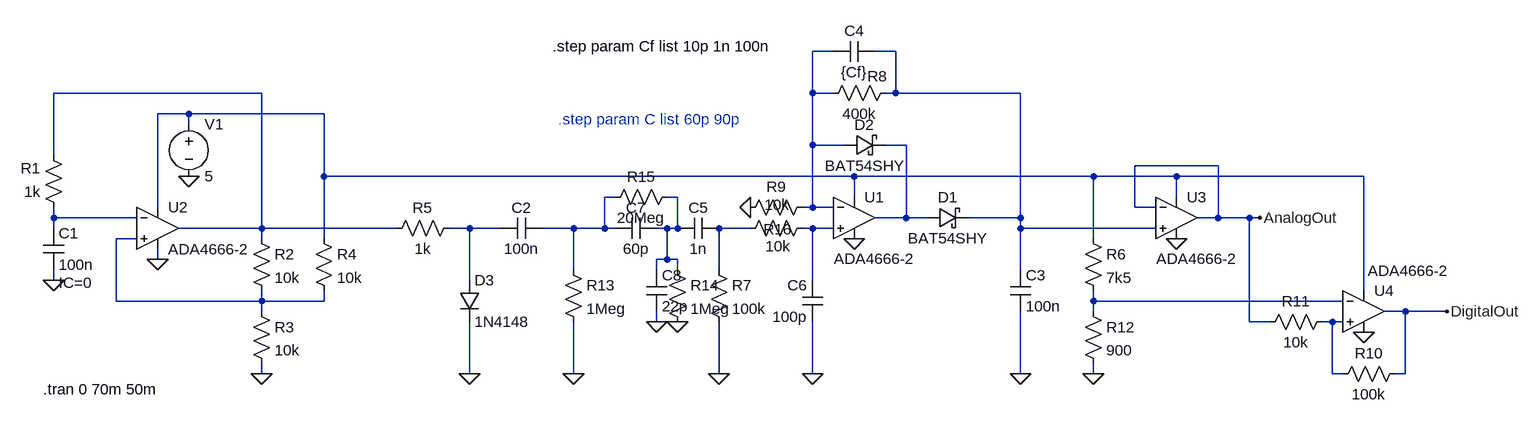
[diagram p0: schematic RainSensor.asc]
RainSensor.asc, the LTspice schematic file:
Version 4
SHEET 1 2296 680
WIRE 1216 -192 1184 -192
WIRE 1312 -192 1280 -192
WIRE 336 -128 16 -128
WIRE 1184 -128 1184 -192
WIRE 1216 -128 1184 -128
WIRE 1312 -128 1312 -192
WIRE 1312 -128 1296 -128
WIRE 1504 -128 1312 -128
WIRE 224 -96 176 -96
WIRE 432 -96 224 -96
WIRE 224 -80 224 -96
WIRE 1184 -48 1184 -128
WIRE 1232 -48 1184 -48
WIRE 1328 -48 1296 -48
WIRE 16 -32 16 -128
WIRE 1808 -16 1680 -16
WIRE 432 0 432 -96
WIRE 1248 0 432 0
WIRE 1616 0 1248 0
WIRE 1744 0 1616 0
WIRE 2032 0 1744 0
WIRE 880 32 864 32
WIRE 976 32 960 32
WIRE 1248 32 1248 0
WIRE 1744 32 1744 0
WIRE 176 48 176 -96
WIRE 1184 48 1184 -48
WIRE 1184 48 1168 48
WIRE 1216 48 1184 48
WIRE 1680 48 1680 -16
WIRE 1712 48 1680 48
WIRE 16 64 16 48
WIRE 144 64 16 64
WIRE 1328 64 1328 -48
WIRE 1328 64 1280 64
WIRE 1360 64 1328 64
WIRE 1504 64 1504 -128
WIRE 1504 64 1424 64
WIRE 1808 64 1808 -16
WIRE 1808 64 1776 64
WIRE 1856 64 1808 64
WIRE 1872 64 1856 64
WIRE 16 80 16 64
WIRE 336 80 336 -128
WIRE 336 80 208 80
WIRE 544 80 336 80
WIRE 656 80 624 80
WIRE 704 80 656 80
WIRE 816 80 768 80
WIRE 864 80 864 32
WIRE 864 80 816 80
WIRE 880 80 864 80
WIRE 960 80 944 80
WIRE 976 80 976 32
WIRE 976 80 960 80
WIRE 1088 80 1040 80
WIRE 1184 80 1168 80
WIRE 1216 80 1184 80
WIRE 1504 80 1504 64
WIRE 1712 80 1504 80
WIRE 144 96 112 96
WIRE 336 96 336 80
WIRE 432 96 432 0
WIRE 1616 96 1616 0
WIRE 176 128 176 112
WIRE 960 128 960 80
WIRE 960 128 944 128
WIRE 976 128 960 128
WIRE 816 144 816 80
WIRE 944 144 944 128
WIRE 976 144 976 128
WIRE 1040 144 1040 80
WIRE 1504 144 1504 80
WIRE 16 160 16 144
WIRE 656 160 656 80
WIRE 1184 160 1184 80
WIRE 2032 176 2032 0
WIRE 112 192 112 96
WIRE 336 192 336 176
WIRE 336 192 112 192
WIRE 432 192 432 176
WIRE 432 192 336 192
WIRE 1616 192 1616 176
WIRE 2000 192 1616 192
WIRE 336 208 336 192
WIRE 1616 208 1616 192
WIRE 2096 208 2064 208
WIRE 2160 208 2096 208
WIRE 944 224 944 208
WIRE 1856 224 1856 64
WIRE 1888 224 1856 224
WIRE 1984 224 1968 224
WIRE 2000 224 1984 224
WIRE 336 304 336 288
WIRE 656 304 656 224
WIRE 816 304 816 224
WIRE 1040 304 1040 224
WIRE 1184 304 1184 224
WIRE 1504 304 1504 208
WIRE 1616 304 1616 288
WIRE 1984 304 1984 224
WIRE 2000 304 1984 304
WIRE 2096 304 2096 208
WIRE 2096 304 2080 304
FLAG 224 0 0
FLAG 176 128 0
FLAG 16 160 0
FLAG 336 304 0
FLAG 656 304 0
FLAG 1040 304 0
FLAG 1248 96 0
FLAG 1088 48 0
FLAG 1504 304 0
FLAG 1744 96 0
FLAG 2032 240 0
FLAG 1616 304 0
FLAG 2160 208 DigitalOut
FLAG 1872 64 AnalogOut
FLAG 816 304 0
FLAG 1184 304 0
FLAG 976 224 0
FLAG 944 224 0
SYMBOL voltage 224 -96 R0
WINDOW 123 0 0 Left 0
WINDOW 39 0 0 Left 0
SYMATTR InstName V1
SYMATTR Value 5
SYMBOL res 32 64 R180
WINDOW 0 36 76 Left 2
WINDOW 3 36 40 Left 2
SYMATTR InstName R1
SYMATTR Value 1k
SYMBOL res 320 80 R0
SYMATTR InstName R2
SYMATTR Value 10k
SYMBOL res 320 192 R0
SYMATTR InstName R3
SYMATTR Value 10k
SYMBOL cap 0 80 R0
WINDOW 39 24 84 Left 2
SYMATTR SpiceLine IC=0
SYMATTR InstName C1
SYMATTR Value 100n
SYMBOL OpAmps\\ADA4666-2 176 16 R0
SYMATTR InstName U2
SYMBOL res 416 80 R0
SYMATTR InstName R4
SYMATTR Value 10k
SYMBOL res 640 64 R90
WINDOW 0 0 56 VBottom 2
WINDOW 3 32 56 VTop 2
SYMATTR InstName R5
SYMATTR Value 1k
SYMBOL cap 768 64 R90
WINDOW 0 0 32 VBottom 2
WINDOW 3 32 32 VTop 2
SYMATTR InstName C2
SYMATTR Value 100n
SYMBOL res 1024 128 R0
SYMATTR InstName R7
SYMATTR Value 100k
SYMBOL OpAmps\\ADA4666-2 1248 0 R0
WINDOW 3 -31 127 Left 2
SYMATTR InstName U1
SYMBOL res 1312 -144 R90
WINDOW 0 6 28 VBottom 2
WINDOW 3 32 56 VTop 2
SYMATTR InstName R8
SYMATTR Value 400k
SYMBOL res 1184 32 R90
WINDOW 0 0 56 VBottom 2
WINDOW 3 -4 55 VTop 2
SYMATTR InstName R9
SYMATTR Value 10k
SYMBOL cap 1488 144 R0
WINDOW 39 24 84 Left 2
SYMATTR InstName C3
SYMATTR Value 100n
SYMBOL schottky 1232 -32 R270
WINDOW 0 32 32 VTop 2
WINDOW 3 0 32 VBottom 2
SYMATTR InstName D2
SYMATTR Value BAT54SHY
SYMATTR Description Diode
SYMATTR Type diode
SYMBOL OpAmps\\ADA4666-2 1744 0 R0
WINDOW 3 -31 127 Left 2
SYMATTR InstName U3
SYMBOL schottky 1360 80 R270
WINDOW 0 32 32 VTop 2
WINDOW 3 0 32 VBottom 2
SYMATTR InstName D1
SYMATTR Value BAT54SHY
SYMATTR Description Diode
SYMATTR Type diode
SYMBOL diode 640 160 R0
SYMATTR InstName D3
SYMATTR Value 1N4148
SYMBOL cap 1280 -208 R90
WINDOW 0 0 32 VBottom 2
WINDOW 3 32 32 VTop 2
SYMATTR InstName C4
SYMATTR Value {Cf}
SYMBOL OpAmps\\ADA4666-2 2032 144 R0
WINDOW 3 6 1 Left 2
SYMATTR InstName U4
SYMBOL res 2096 288 R90
WINDOW 0 0 56 VBottom 2
WINDOW 3 32 56 VTop 2
SYMATTR InstName R10
SYMATTR Value 100k
SYMBOL res 1600 80 R0
SYMATTR InstName R6
SYMATTR Value 7k5
SYMBOL res 1600 192 R0
SYMATTR InstName R12
SYMATTR Value 900
SYMBOL res 1984 208 R90
WINDOW 0 0 56 VBottom 2
WINDOW 3 32 56 VTop 2
SYMATTR InstName R11
SYMATTR Value 10k
SYMBOL res 800 128 R0
SYMATTR InstName R13
SYMATTR Value 1Meg
SYMBOL cap 1040 64 R90
WINDOW 0 0 32 VBottom 2
WINDOW 3 32 32 VTop 2
SYMATTR InstName C5
SYMATTR Value 1n
SYMBOL cap 1200 224 R180
WINDOW 0 24 56 Left 2
WINDOW 3 24 8 Left 2
SYMATTR InstName C6
SYMATTR Value 100p
SYMBOL cap 944 64 R90
WINDOW 0 0 32 VBottom 2
WINDOW 3 32 32 VTop 2
SYMATTR InstName C7
SYMATTR Value 60p
SYMBOL res 976 16 R90
WINDOW 0 0 56 VBottom 2
WINDOW 3 32 56 VTop 2
SYMATTR InstName R15
SYMATTR Value 20Meg
SYMBOL res 1184 64 R90
WINDOW 0 33 54 VBottom 2
WINDOW 3 28 53 VTop 2
SYMATTR InstName R16
SYMATTR Value 10k
SYMBOL res 960 128 R0
SYMATTR InstName R14
SYMATTR Value 1Meg
SYMBOL cap 928 144 R0
SYMATTR InstName C8
SYMATTR Value 22p
TEXT 0 328 Left 2 !.tran 0 70m 50m
TEXT 792 -88 Left 2 ;.step param C list 60p 90p
TEXT 784 -200 Left 2 !.step param Cf list 10p 1n 100n

The netlist it stands for:
* RainSensor.asc
V1 N004 0 5
R1 N008 N003 1k
R2 N003 N012 10k
R3 N012 0 10k
C1 N008 0 100n IC=0
XU2 N012 N008 N004 0 N003 ADA4666-2  ; pins In+ In- V+ V- OUT
R4 N004 N012 10k
R5 N009 N003 1k
C2 N006 N009 100n
R7 N010 0 100k
XU1 N011 N001 N004 0 N005 ADA4666-2  ; pins In+ In- V+ V- OUT
R8 N002 N001 400k
R9 N001 0 10k
C3 N002 0 100n
D2 N001 N005 BAT54SHY
XU3 N002 AnalogOut N004 0 AnalogOut ADA4666-2  ; pins In+ In- V+ V- OUT
D1 N005 N002 BAT54SHY
D3 N009 0 1N4148
C4 N002 N001 {Cf}
XU4 N014 N013 N004 0 DigitalOut ADA4666-2  ; pins In+ In- V+ V- OUT
R10 DigitalOut N014 100k
R6 N004 N013 7k5
R12 N013 0 900
R11 N014 AnalogOut 10k
R13 N006 0 1Meg
C5 N010 N007 1n
C6 0 N011 100p
C7 N007 N006 60p
R15 N007 N006 20Meg
R16 N011 N010 10k
R14 N007 0 1Meg
C8 N007 0 22p
.model D D
.lib standard.dio
.tran 0 70m 50m
* .step param C list 60p 90p
.step param Cf list 10p 1n 100n
.backanno
.end